# Altium schematic sheet 0_Architecture.SchDoc: OBDH Hardware Archictecture
size A4; DrawnBy: André M. P. Mattos; Engineer: Eng_2_ALT; Revision: V0.2; SheetNumber: 0; SheetTotal: 6
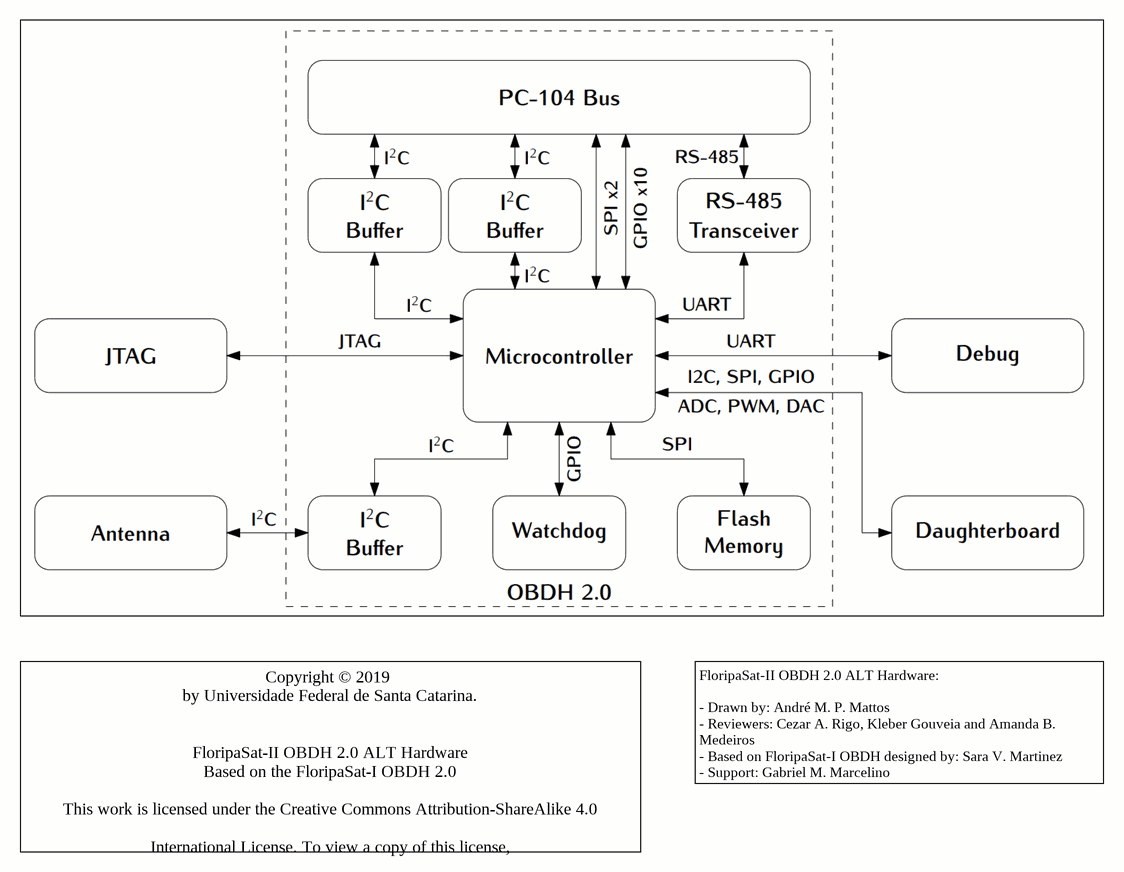
[diagram p0: 0_Architecture.SchDoc]

## Notes on the sheet
- FloripaSat-II OBDH 2.0 ALT Hardware:
  - Drawn by: André M. P. Mattos
  - Reviewers: Cezar A. Rigo, Kleber Gouveia and Amanda B. Medeiros
  - Based on FloripaSat-I OBDH designed by: Sara V. Martinez
  - Support: Gabriel M. Marcelino
- Copyright © 2019
  by Universidade Federal de Santa Catarina.
  FloripaSat-II OBDH 2.0 ALT Hardware
  Based on the FloripaSat-I OBDH 2.0
  This work is licensed under the Creative Commons Attribution-ShareAlike 4.0
  International License. To view a copy of this license,
  visit http://creativecommons.org/licenses/by-sa/4.0/.
- Title
- Size:
- Date:
- A4
- Project:
- Time:
- FloripaSat
- Revision:
- Sheet
- of
- UFSC - SpaceLab
- University Campus - Trindade
- Dep. of Electrical Engineering - CTC
- Florianópolis, Santa Catarina, Brazil
- Drawn By:
- Model:
- CEP: 88040 - 900